# Altium schematic sheet tapegyseg.SchDoc
size A4
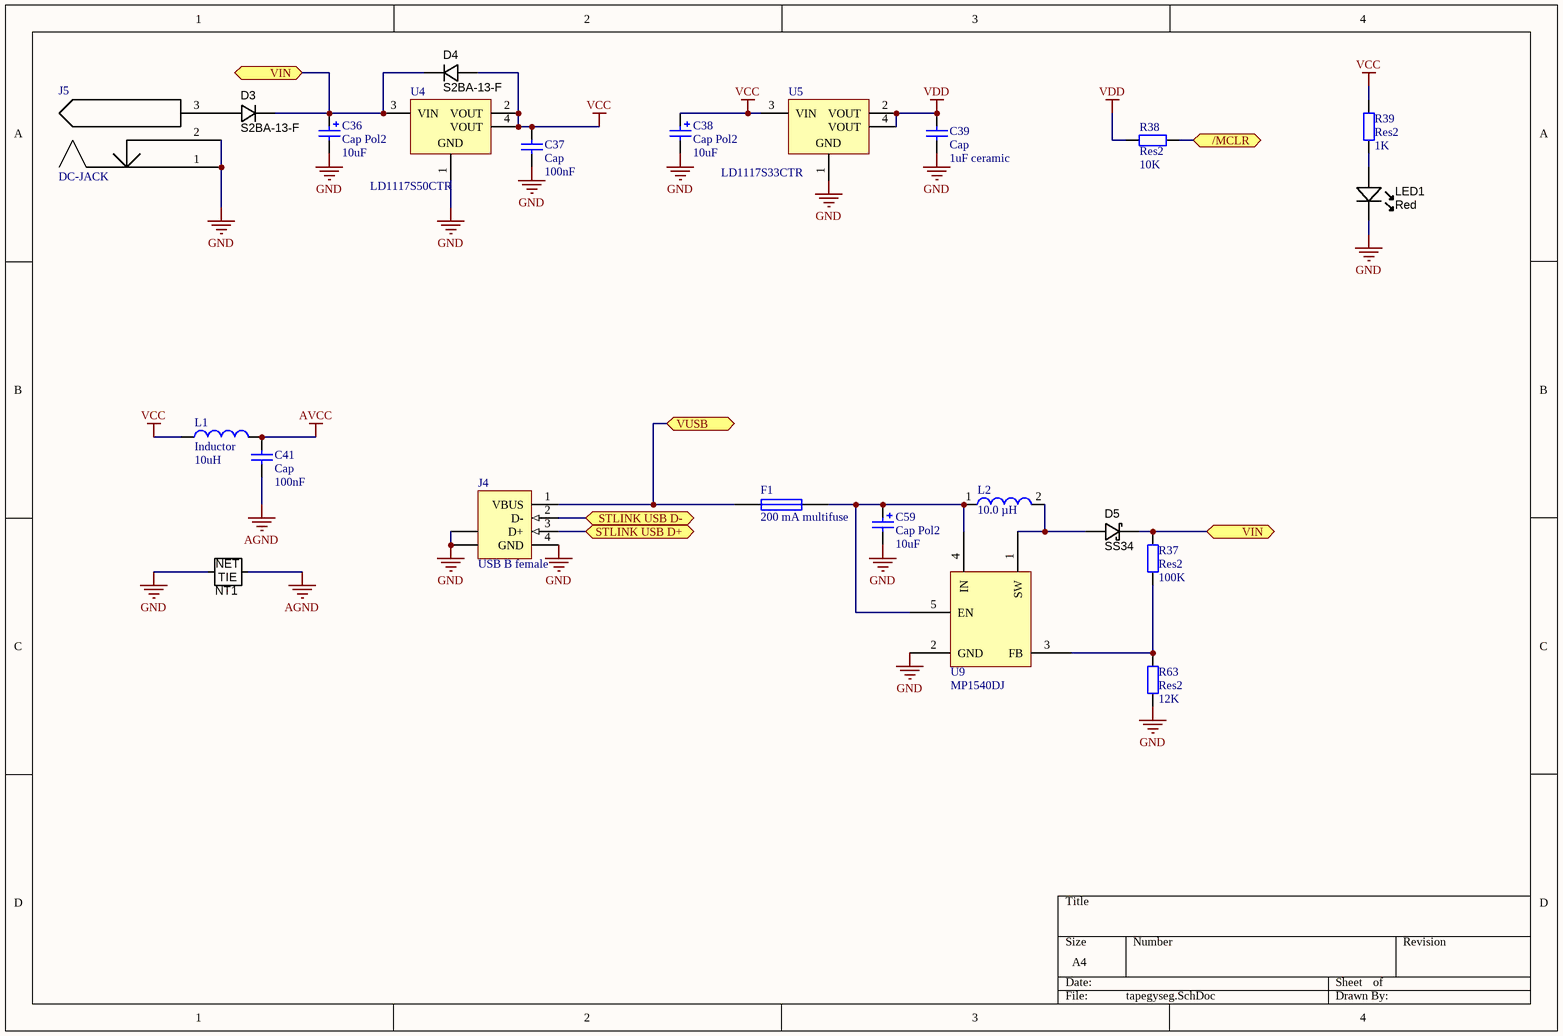
[diagram p0: tapegyseg.SchDoc]

## Parts
C36  Cap Pol2  value 10uF  [CAPMP3528X210N]
C37  Cap  value 100nF  [CAPC2012X135N]
C38  Cap Pol2  value 10uF  [CAPMP3528X210N]
C39  Cap  value 1uF ceramic  [CAPC2012X135N]
C41  Cap  value 100nF  [CAPC2012X135N]
C59  Cap Pol2  value 10uF  [CAPMP3528X210N]
D3  Manufacturer Part Number 1: S2BA-13-F  [DO-214AC]  (hidden comment: 100V; 1.5A)
D4  Manufacturer Part Number 1: S2BA-13-F  [DO-214AC]  (hidden comment: 100V; 1.5A)
D5  SS34  [DO-214AA]
F1  200 mA multifuse  [RESC6332X70N]
J4  USB B female  [1437106]
J5  DC-JACK  [JACK]
L1  Inductor  value 10uH  [6-0805_N]
L2  Inductance: 10.0 µH  [WE-PD2-MS]  (hidden comment: 7447745100)
LED1  Color: Red  [LED-0805-K]
NT1  Net Tie  [NetTie_External_24mil]  (value not drawn)  (net tie, no BOM)
R37  Res2  value 100K  [RESC2012X70N]
R38  Res2  value 10K  [RESC2012X70N]
R39  Res2  value 1K  [RESC2012X70N]
R63  Res2  value 12K  [RESC2012X70N]
U4  LD1117S50CTR  [SOT-223_M]
U5  LD1117S33CTR  [SOT-223_L]
U9  MP1540DJ  [S5]

## Ports
/MCLR, STLINK USB D+ (bidir), STLINK USB D- (bidir), VIN, VUSB

## Nets
AGND: C41.1 NT1.2
AVCC: C41.2 L1.2
GND: C36.2 C37.1 C38.2 C39.1 C59.2 J4.4(GND) J4.5(SHLD) J4.6(SHLD) J5.1 J5.2 LED1.K NT1.1 R63.1 U4.1(GND) U5.1(GND) U9.2(GND)
VCC: C37.2 C38.1 D4.A L1.1 R39.2 U4.2(VOUT) U4.4(VOUT) U5.3(VIN)
VDD: C39.2 R38.1 U5.2(VOUT) U5.4(VOUT)
/MCLR: R38.2 ; port /MCLR
STLINK USB D+: J4.3(D+) ; port STLINK USB D+
STLINK USB D-: J4.2(D-) ; port STLINK USB D-
VIN: C36.1 D3.K D4.K D5.K R37.2 U4.3(VIN) ; port VIN
VUSB: F1.1 J4.1(VBUS) ; port VUSB
NetC59_1: C59.1 F1.2 L2.1 U9.4(IN) U9.5(EN)
NetD3_A: D3.A J5.3
NetD5_A: D5.A L2.2 U9.1(SW)
NetLED1_A: LED1.A R39.1
NetR37_1: R37.1 R63.2 U9.3(FB)

## Notes on the sheet
- (in symbol JUMP_NETTIE) NET; TIE

## Library data of the parts
C36 C38 C59 = Cap Pol2: Polarized Capacitor (Axial); Published: 8-Jun-2000; LatestRevisionDate: 17-Jul-2002; LatestRevisionNote: Re-released for DXP Platform.; PackageReference: POLAR0.8; Publisher: Altium Limited; PackageDescription: Polarized Capacitor; 2 Leads
C37 C39 C41 = Cap: Capacitor; Published: 8-Jun-2000; LatestRevisionDate: 17-Jul-2002; LatestRevisionNote: Re-released for DXP Platform.; PackageReference: RAD-0.3; Publisher: Altium Limited; PackageDescription: Radial Cap, Thru-Hole; 2 Leads; 0.3 in Pin Spacing
D3 D4 = DIODE_100V_1.5A_SMA: Diode SMD 100V 1.5A SMA; Manufacturer 1: Diodes Inc; Material: Si; Diode Type: Standard; Value: Vf = 1.15V @ 1.5A (Max); SCDType: source; Package / Case: DO-214AC, SMA; Ratings: 100V; 1.5A; Supplier 1: Digi-Key; Supplier Part Number 1: S2BA-FDICT-ND
D5 = DIODE_SCHOTTKY_MBRS130L: Diode Schottky SMD 30V 2A DO-214AA; Manufacturer 1: Fairchild Semiconductor; Material: Si; Ratings: 30Vr; 2A; SCDType: source; Package / Case: DO-214AA, SMB; Supplier 1: Digi-Key; Supplier Part Number 1: MBRS130LFSCT-ND; Manufacturer Part Number 1: MBRS130L
F1 = Fuse 1: Fuse; Published: 8-Jun-2000; LatestRevisionDate: 17-Jul-2002; LatestRevisionNote: Re-released for DXP Platform.; PackageReference: PIN-W2/E2.8; Publisher: Altium Limited; PackageDescription: 1210
J4 = 4-1437106-8: USB 1.1, Right Angle, Thru-Hole, B Type, Receptacle, 4 Position, Natural; ContactMaterial: Copper Alloy; ContactPlating: Gold (30); TerminationLength: 2.90mm [0.114in.]; PCB_Layout: Complies with manufacturer's recommendation.; DrillSize: Corresponds to nominal value.; PanelGround: Without; Published: 15-Jul-2004; DatasheetDocument: 05-Jan-2004; PackageDocument: 05-Jan-2004; PackageReference: 1437106; Publisher: Altium Limited; HousingMaterial: Glass-Filled Thermoplastic; ComponentLink1Description: Manufacturer Link; ComponentLink1URL: http://www.tycoelectronics.com/; ComponentLink2Description: Packaging Specification; ComponentLink2URL: http://ecommas.tycoelectronics.com/commerce/DocumentDelivery/DDEController?Action=showdoc&DocId=Customer+Drawing%7F1437106%7FC%7Ftif%7FEnglish%7FENG_CD_1437106_C.tif
J5 = DC-JACK: Tápcsatlakozó
L1 = Inductor: Code_IEC: 1005; Published: 8-Jun-2000; LatestRevisionDate: 29-May-2009; LatestRevisionNote: IPC-7351 Footprint Added.; PackageReference: 0402-A; Publisher: Altium Limited; PackageDescription: Chip Inductor; Code_JEITA: 0402
L2 = 7447745100: SMD Power Inductor WE-PD2, L = 10.0 µH; DatasheetVersion: ver 2, May-2009; PackageVersion: 2009; PackageReference: WE-PD2-MS; PackageDescription: SMD Inductor, 2-Leads, Body 5.8 x 5.2 mm; ComponentLink1Description: Manufacturer URL; ComponentLink1URL: http://www.we-online.com; ComponentLink2Description: Datasheet; ComponentLink2URL: http://www.we-online.de/katalog/media/pdf/7447745100.pdf
LED1 = LED_SMD_Red_0805_6mcd: LED 0805 SMD Red 6mcd 621nm; Manufacturer 1: Lite-On Inc; Manufacturer Part Number 1: LTST-C171EKT; Material: GaAsP on GaP; Ratings: 6 mcd; 621 nm; SCDType: source; Package / Case: 0805; Supplier 1: Digi-Key; Supplier Part Number 1: 160-1422-1-ND; Value: Red
NT1 = JUMP_NETTIE
R37-R39 R63 = Res2: Resistor; Published: 8-Jun-2000; LatestRevisionDate: 17-Jul-2002; LatestRevisionNote: Re-released for DXP Platform.; PackageReference: AXIAL-0.4; Publisher: Altium Limited; PackageDescription: Axial Device, Thru-Hole; 2 Leads; 0.4 in Pin Spacing
U4 = LD1117S50CTR: Fixed Low Drop Positive Voltage Regulator, 5V, 4-Pin SOT-223, Tape and Reel; DatasheetVersion: Nov-2011; PackageVersion: 2010; PackageReference: SOT-223; PackageDescription: 4-Pin SOT-223 Package, 6.5 x 3.5 mm Body, 2.3 mm Pitch, 7 mm Lead Span; PartNumber: LD1117S50CTR; ComponentLink1Description: Manufacturer URL; ComponentLink1URL: http://www.st.com; ComponentLink2Description: Datasheet; ComponentLink2URL: http://www.st.com/internet/com/TECHNICAL_RESOURCES/TECHNICAL_LITERATURE/DATASHEET/CD00000544.pdf
U5 = LD1117S33CTR: Fixed Low Drop Positive Voltage Regulator, 3.3V, 4-Pin SOT-223, Tape and Reel; DatasheetVersion: Nov-2011; PackageVersion: 2010; PackageReference: SOT-223; PackageDescription: 4-Pin SOT-223 Package, 6.5 x 3.5 mm Body, 2.3 mm Pitch, 7 mm Lead Span; PartNumber: LD1117S33CTR; ComponentLink1Description: Manufacturer URL; ComponentLink1URL: http://www.st.com; ComponentLink2Description: Datasheet; ComponentLink2URL: http://www.st.com/internet/com/TECHNICAL_RESOURCES/TECHNICAL_LITERATURE/DATASHEET/CD00000544.pdf
U9 = MP1540: Step-up converter